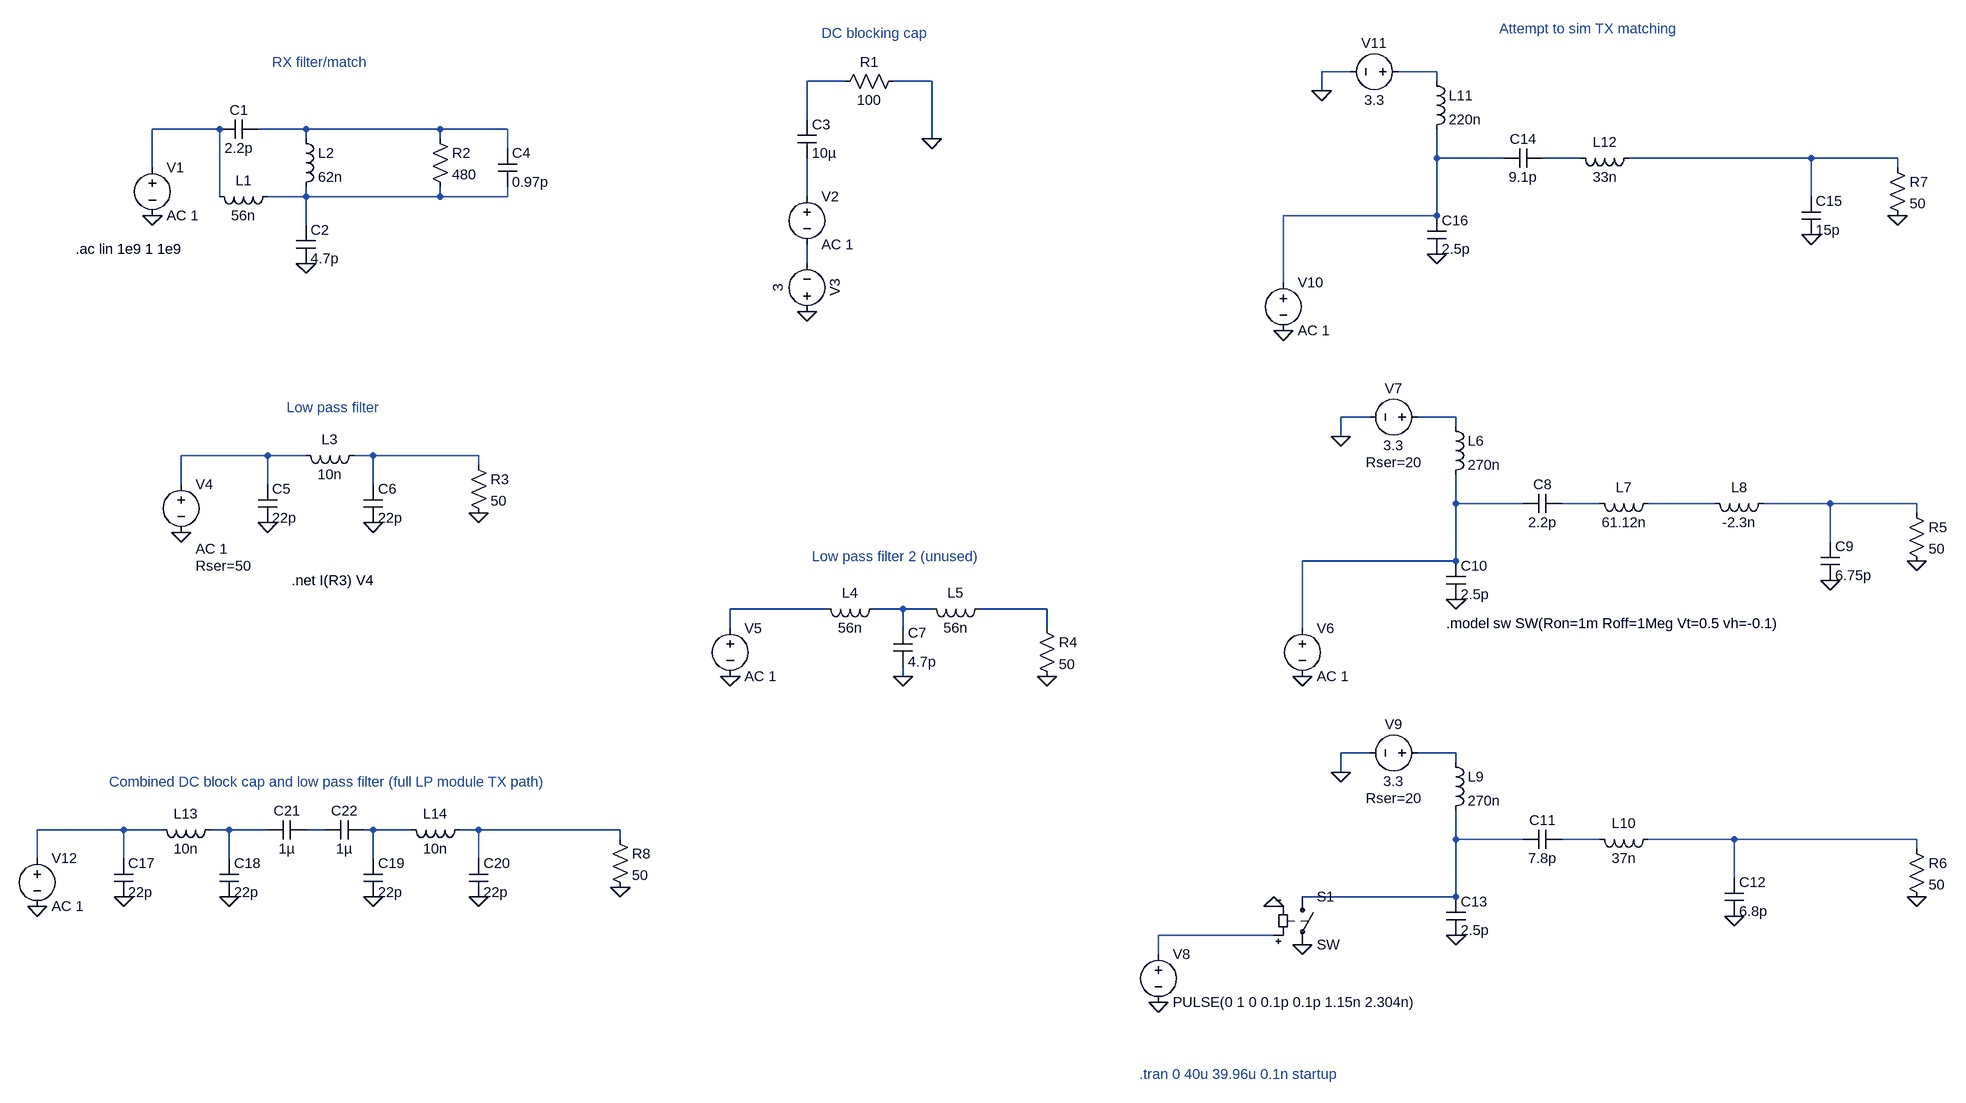
[diagram p0: schematic LP_module.asc]
LP_module.asc, the LTspice schematic file:
Version 4
SHEET 1 2808 1236
WIRE 1808 -464 1760 -464
WIRE 1952 -464 1888 -464
WIRE 576 -448 512 -448
WIRE 720 -448 656 -448
WIRE 1952 -448 1952 -464
WIRE 1760 -432 1760 -464
WIRE 512 -384 512 -448
WIRE -544 -368 -656 -368
WIRE -400 -368 -480 -368
WIRE -176 -368 -400 -368
WIRE -64 -368 -176 -368
WIRE -400 -352 -400 -368
WIRE -176 -352 -176 -368
WIRE 720 -352 720 -448
WIRE -64 -336 -64 -368
WIRE 1952 -320 1952 -368
WIRE 2064 -320 1952 -320
WIRE 2192 -320 2128 -320
WIRE 2576 -320 2272 -320
WIRE 2720 -320 2576 -320
WIRE -656 -304 -656 -368
WIRE 2720 -304 2720 -320
WIRE -544 -256 -544 -368
WIRE -400 -256 -400 -272
WIRE -400 -256 -464 -256
WIRE -176 -256 -176 -272
WIRE -176 -256 -400 -256
WIRE -64 -256 -64 -272
WIRE -64 -256 -176 -256
WIRE 512 -256 512 -320
WIRE 2576 -256 2576 -320
WIRE 1952 -224 1952 -320
WIRE 1952 -224 1696 -224
WIRE -400 -208 -400 -256
WIRE 512 -144 512 -176
WIRE 1696 -112 1696 -224
WIRE 1840 112 1792 112
WIRE 1984 112 1920 112
WIRE 1984 128 1984 112
WIRE 1792 144 1792 112
WIRE -464 176 -608 176
WIRE -400 176 -464 176
WIRE -288 176 -320 176
WIRE -112 176 -288 176
WIRE -112 192 -112 176
WIRE -608 224 -608 176
WIRE -464 224 -464 176
WIRE -288 224 -288 176
WIRE 1984 256 1984 208
WIRE 2096 256 1984 256
WIRE 2224 256 2160 256
WIRE 2416 256 2304 256
WIRE 2608 256 2496 256
WIRE 2752 256 2608 256
WIRE 2752 272 2752 256
WIRE 2608 320 2608 256
WIRE 1984 352 1984 256
WIRE 1984 352 1728 352
WIRE 544 432 384 432
WIRE 672 432 624 432
WIRE 720 432 672 432
WIRE 912 432 800 432
WIRE 384 464 384 432
WIRE 672 464 672 432
WIRE 912 464 912 432
WIRE 1728 464 1728 352
WIRE 672 544 672 528
WIRE 1840 672 1792 672
WIRE 1984 672 1920 672
WIRE 1984 688 1984 672
WIRE 1792 704 1792 672
WIRE -704 800 -848 800
WIRE -640 800 -704 800
WIRE -528 800 -560 800
WIRE -464 800 -528 800
WIRE -368 800 -400 800
WIRE -288 800 -304 800
WIRE -224 800 -288 800
WIRE -112 800 -144 800
WIRE 144 800 -112 800
WIRE 144 816 144 800
WIRE 1984 816 1984 768
WIRE 2096 816 1984 816
WIRE 2224 816 2160 816
WIRE 2448 816 2304 816
WIRE 2752 816 2448 816
WIRE 2752 832 2752 816
WIRE -848 848 -848 800
WIRE -704 848 -704 800
WIRE -528 848 -528 800
WIRE -288 848 -288 800
WIRE -112 848 -112 800
WIRE 2448 880 2448 816
WIRE 1984 912 1984 816
WIRE 1984 912 1728 912
WIRE 1680 976 1488 976
WIRE 1488 1008 1488 976
FLAG -656 -224 0
FLAG -400 -144 0
FLAG 512 -64 0
FLAG 720 -352 0
FLAG -112 272 0
FLAG -608 304 0
FLAG -288 288 0
FLAG -464 288 0
FLAG 672 544 0
FLAG 912 544 0
FLAG 384 544 0
FLAG 2752 352 0
FLAG 2608 384 0
FLAG 1728 544 0
FLAG 1792 144 0
FLAG 1984 416 0
FLAG 2752 912 0
FLAG 2448 944 0
FLAG 1488 1088 0
FLAG 1792 704 0
FLAG 1984 976 0
FLAG 1728 992 0
FLAG 1680 928 0
FLAG 2720 -224 0
FLAG 2576 -192 0
FLAG 1696 -32 0
FLAG 1760 -432 0
FLAG 1952 -160 0
FLAG 144 896 0
FLAG -848 928 0
FLAG -528 912 0
FLAG -704 912 0
FLAG -112 912 0
FLAG -288 912 0
SYMBOL voltage -656 -320 R0
SYMATTR InstName V1
SYMATTR Value AC 1
SYMBOL cap -480 -384 R90
WINDOW 0 0 32 VBottom 2
WINDOW 3 32 32 VTop 2
SYMATTR InstName C1
SYMATTR Value 2.2p
SYMBOL ind -448 -272 R90
WINDOW 0 5 56 VBottom 2
WINDOW 3 32 56 VTop 2
SYMATTR InstName L1
SYMATTR Value 56n
SYMBOL ind -416 -368 R0
SYMATTR InstName L2
SYMATTR Value 62n
SYMBOL cap -416 -208 R0
SYMATTR InstName C2
SYMATTR Value 4.7p
SYMBOL voltage 512 -272 R0
SYMATTR InstName V2
SYMATTR Value AC 1
SYMBOL cap 496 -384 R0
SYMATTR InstName C3
SYMATTR Value 10µ
SYMBOL res 672 -464 R90
WINDOW 0 0 56 VBottom 2
WINDOW 3 32 56 VTop 2
SYMATTR InstName R1
SYMATTR Value 100
SYMBOL voltage 512 -48 R180
WINDOW 0 -32 56 VBottom 2
WINDOW 3 32 56 VTop 2
WINDOW 123 0 0 Left 0
WINDOW 39 60 56 VTop 2
SYMATTR InstName V3
SYMATTR Value 3
SYMBOL res -192 -368 R0
SYMATTR InstName R2
SYMATTR Value 480
SYMBOL cap -80 -336 R0
SYMATTR InstName C4
SYMATTR Value 0.97p
SYMBOL voltage -608 208 R0
WINDOW 123 24 124 Left 2
WINDOW 39 24 152 Left 2
SYMATTR Value2 AC 1
SYMATTR SpiceLine Rser=50
SYMATTR InstName V4
SYMATTR Value ""
SYMBOL cap -480 224 R0
SYMATTR InstName C5
SYMATTR Value 22p
SYMBOL cap -304 224 R0
SYMATTR InstName C6
SYMATTR Value 22p
SYMBOL ind -304 160 R90
WINDOW 0 5 56 VBottom 2
WINDOW 3 32 56 VTop 2
SYMATTR InstName L3
SYMATTR Value 10n
SYMBOL res -128 176 R0
SYMATTR InstName R3
SYMATTR Value 50
SYMBOL voltage 384 448 R0
SYMATTR InstName V5
SYMATTR Value AC 1
SYMBOL ind 640 416 R90
WINDOW 0 5 56 VBottom 2
WINDOW 3 32 56 VTop 2
SYMATTR InstName L4
SYMATTR Value 56n
SYMBOL ind 816 416 R90
WINDOW 0 5 56 VBottom 2
WINDOW 3 32 56 VTop 2
SYMATTR InstName L5
SYMATTR Value 56n
SYMBOL cap 656 464 R0
SYMATTR InstName C7
SYMATTR Value 4.7p
SYMBOL res 896 448 R0
SYMATTR InstName R4
SYMATTR Value 50
SYMBOL voltage 1728 448 R0
SYMATTR InstName V6
SYMATTR Value AC 1
SYMBOL ind 1968 112 R0
SYMATTR InstName L6
SYMATTR Value 270n
SYMBOL voltage 1936 112 R90
WINDOW 0 -32 56 VBottom 2
WINDOW 3 32 56 VTop 2
WINDOW 123 0 0 Left 0
WINDOW 39 60 56 VTop 2
SYMATTR InstName V7
SYMATTR Value 3.3
SYMATTR SpiceLine Rser=20
SYMBOL cap 2160 240 R90
WINDOW 0 0 32 VBottom 2
WINDOW 3 32 32 VTop 2
SYMATTR InstName C8
SYMATTR Value 2.2p
SYMBOL ind 2320 240 R90
WINDOW 0 5 56 VBottom 2
WINDOW 3 32 56 VTop 2
SYMATTR InstName L7
SYMATTR Value 61.12n
SYMBOL cap 2592 320 R0
SYMATTR InstName C9
SYMATTR Value 6.75p
SYMBOL res 2736 256 R0
SYMATTR InstName R5
SYMATTR Value 50
SYMBOL ind 2512 240 R90
WINDOW 0 5 56 VBottom 2
WINDOW 3 32 56 VTop 2
SYMATTR InstName L8
SYMATTR Value -2.3n
SYMBOL cap 1968 352 R0
SYMATTR InstName C10
SYMATTR Value 2.5p
SYMBOL voltage 1488 992 R0
SYMATTR InstName V8
SYMATTR Value PULSE(0 1 0 0.1p 0.1p 1.15n 2.304n)
SYMBOL ind 1968 672 R0
SYMATTR InstName L9
SYMATTR Value 270n
SYMBOL voltage 1936 672 R90
WINDOW 0 -32 56 VBottom 2
WINDOW 3 32 56 VTop 2
WINDOW 123 0 0 Left 0
WINDOW 39 60 56 VTop 2
SYMATTR InstName V9
SYMATTR Value 3.3
SYMATTR SpiceLine Rser=20
SYMBOL cap 2160 800 R90
WINDOW 0 0 32 VBottom 2
WINDOW 3 32 32 VTop 2
SYMATTR InstName C11
SYMATTR Value 7.8p
SYMBOL ind 2320 800 R90
WINDOW 0 5 56 VBottom 2
WINDOW 3 32 56 VTop 2
SYMATTR InstName L10
SYMATTR Value 37n
SYMBOL cap 2432 880 R0
SYMATTR InstName C12
SYMATTR Value 6.8p
SYMBOL res 2736 816 R0
SYMATTR InstName R6
SYMATTR Value 50
SYMBOL cap 1968 912 R0
SYMATTR InstName C13
SYMATTR Value 2.5p
SYMBOL sw 1728 896 R0
SYMATTR InstName S1
SYMBOL voltage 1696 -128 R0
SYMATTR InstName V10
SYMATTR Value AC 1
SYMBOL ind 1936 -464 R0
SYMATTR InstName L11
SYMATTR Value 220n
SYMBOL voltage 1904 -464 R90
WINDOW 0 -32 56 VBottom 2
WINDOW 3 32 56 VTop 2
WINDOW 123 0 0 Left 0
WINDOW 39 60 56 VTop 2
SYMATTR InstName V11
SYMATTR Value 3.3
SYMBOL cap 2128 -336 R90
WINDOW 0 0 32 VBottom 2
WINDOW 3 32 32 VTop 2
SYMATTR InstName C14
SYMATTR Value 9.1p
SYMBOL ind 2288 -336 R90
WINDOW 0 5 56 VBottom 2
WINDOW 3 32 56 VTop 2
SYMATTR InstName L12
SYMATTR Value 33n
SYMBOL cap 2560 -256 R0
SYMATTR InstName C15
SYMATTR Value 15p
SYMBOL res 2704 -320 R0
SYMATTR InstName R7
SYMATTR Value 50
SYMBOL cap 1936 -224 R0
SYMATTR InstName C16
SYMATTR Value 2.5p
SYMBOL voltage -848 832 R0
SYMATTR InstName V12
SYMATTR Value AC 1
SYMBOL cap -720 848 R0
SYMATTR InstName C17
SYMATTR Value 22p
SYMBOL cap -544 848 R0
SYMATTR InstName C18
SYMATTR Value 22p
SYMBOL ind -544 784 R90
WINDOW 0 5 56 VBottom 2
WINDOW 3 32 56 VTop 2
SYMATTR InstName L13
SYMATTR Value 10n
SYMBOL res 128 800 R0
SYMATTR InstName R8
SYMATTR Value 50
SYMBOL cap -304 848 R0
SYMATTR InstName C19
SYMATTR Value 22p
SYMBOL cap -128 848 R0
SYMATTR InstName C20
SYMATTR Value 22p
SYMBOL ind -128 784 R90
WINDOW 0 5 56 VBottom 2
WINDOW 3 32 56 VTop 2
SYMATTR InstName L14
SYMATTR Value 10n
SYMBOL cap -400 784 R90
WINDOW 0 0 32 VBottom 2
WINDOW 3 32 32 VTop 2
SYMATTR InstName C21
SYMATTR Value 1µ
SYMBOL cap -304 784 R90
WINDOW 0 0 32 VBottom 2
WINDOW 3 32 32 VTop 2
SYMATTR InstName C22
SYMATTR Value 1µ
TEXT -784 -168 Left 2 !.ac lin 1e9 1 1e9
TEXT 1968 456 Left 2 !.model sw SW(Ron=1m Roff=1Meg Vt=0.5 vh=-0.1)
TEXT 1456 1208 Left 2 ;.tran 0 40u 39.96u 0.1n startup
TEXT -456 -480 Left 2 ;RX filter/match
TEXT -432 96 Left 2 ;Low pass filter
TEXT 520 344 Left 2 ;Low pass filter 2 (unused)
TEXT 536 -528 Left 2 ;DC blocking cap
TEXT -728 720 Left 2 ;Combined DC block cap and low pass filter (full LP module TX path)
TEXT 2056 -536 Left 2 ;Attempt to sim TX matching
TEXT -424 384 Left 2 !.net I(R3) V4

The netlist it stands for:
* LP_module.asc
V1 N003 0 AC 1
C1 N004 N003 2.2p
L1 N008 N003 56n
L2 N004 N008 62n
C2 N008 0 4.7p
V2 N009 N010 AC 1
C3 N002 N009 10µ
R1 0 N002 100
V3 0 N010 3
R2 N004 N008 480
C4 N004 N008 0.97p
V4 N012 0 AC 1 Rser=50
C5 N012 0 22p
C6 N013 0 22p
L3 N013 N012 10n
R3 N013 0 50
V5 N018 0 AC 1
L4 N019 N018 56n
L5 N020 N019 56n
C7 N019 0 4.7p
R4 N020 0 50
V6 N014 0 AC 1
L6 N011 N014 270n
V7 N011 0 3.3 Rser=20
C8 N015 N014 2.2p
L7 N016 N015 61.12n
C9 N017 0 6.75p
R5 N017 0 50
L8 N017 N016 -2.3n
C10 N014 0 2.5p
V8 N030 0 PULSE(0 1 0 0.1p 0.1p 1.15n 2.304n)
L9 N021 N027 270n
V9 N021 0 3.3 Rser=20
C11 N028 N027 7.8p
L10 N029 N028 37n
C12 N029 0 6.8p
R6 N029 0 50
C13 N027 0 2.5p
S1 N027 0 N030 0 SW
V10 N005 0 AC 1
L11 N001 N005 220n
V11 N001 0 3.3
C14 N006 N005 9.1p
L12 N007 N006 33n
C15 N007 0 15p
R7 N007 0 50
C16 N005 0 2.5p
V12 N022 0 AC 1
C17 N022 0 22p
C18 N023 0 22p
L13 N023 N022 10n
R8 N026 0 50
C19 N025 0 22p
C20 N026 0 22p
L14 N026 N025 10n
C21 N024 N023 1µ
C22 N025 N024 1µ
.ac lin 1e9 1 1e9
.model sw SW(Ron=1m Roff=1Meg Vt=0.5 vh=-0.1)
* .tran 0 40u 39.96u 0.1n startup
* RX filter/match
* Low pass filter
* Low pass filter 2 (unused)
* DC blocking cap
* Combined DC block cap and low pass filter (full LP module TX path)
* Attempt to sim TX matching
.net I(R3) V4
.backanno
.end